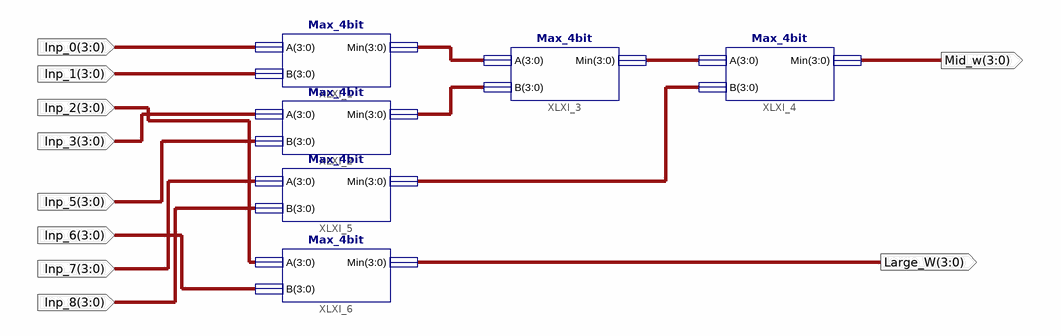
[diagram p0: schematic sheet 1]
// Xilinx ISE schematic Kp_Defuzzy.sch (spartan3e) as structural Verilog: 6 symbols, 10 ports
module Kp_Defuzzy (
  input  [3:0] Inp_0,
  input  [3:0] Inp_3,
  input  [3:0] Inp_7,
  input  [3:0] Inp_8,
  input  [3:0] Inp_5,
  input  [3:0] Inp_1,
  input  [3:0] Inp_2,
  input  [3:0] Inp_6,
  output [3:0] Large_W,
  output [3:0] Mid_w
);

  wire [3:0] XLXN_1, XLXN_2, XLXN_3, XLXN_5;

  Max_4bit XLXI_1 (.A(Inp_0), .B(Inp_1), .Min(XLXN_1));
  Max_4bit XLXI_2 (.A(Inp_3), .B(Inp_5), .Min(XLXN_2));
  Max_4bit XLXI_3 (.A(XLXN_1), .B(XLXN_2), .Min(XLXN_3));
  Max_4bit XLXI_4 (.A(XLXN_3), .B(XLXN_5), .Min(Mid_w));
  Max_4bit XLXI_5 (.A(Inp_7), .B(Inp_8), .Min(XLXN_5));
  Max_4bit XLXI_6 (.A(Inp_2), .B(Inp_6), .Min(Large_W));
endmodule
